# EAGLE design rls_slide_expand_01 (EAGLE 6.4)

## Sheet 1 of 2
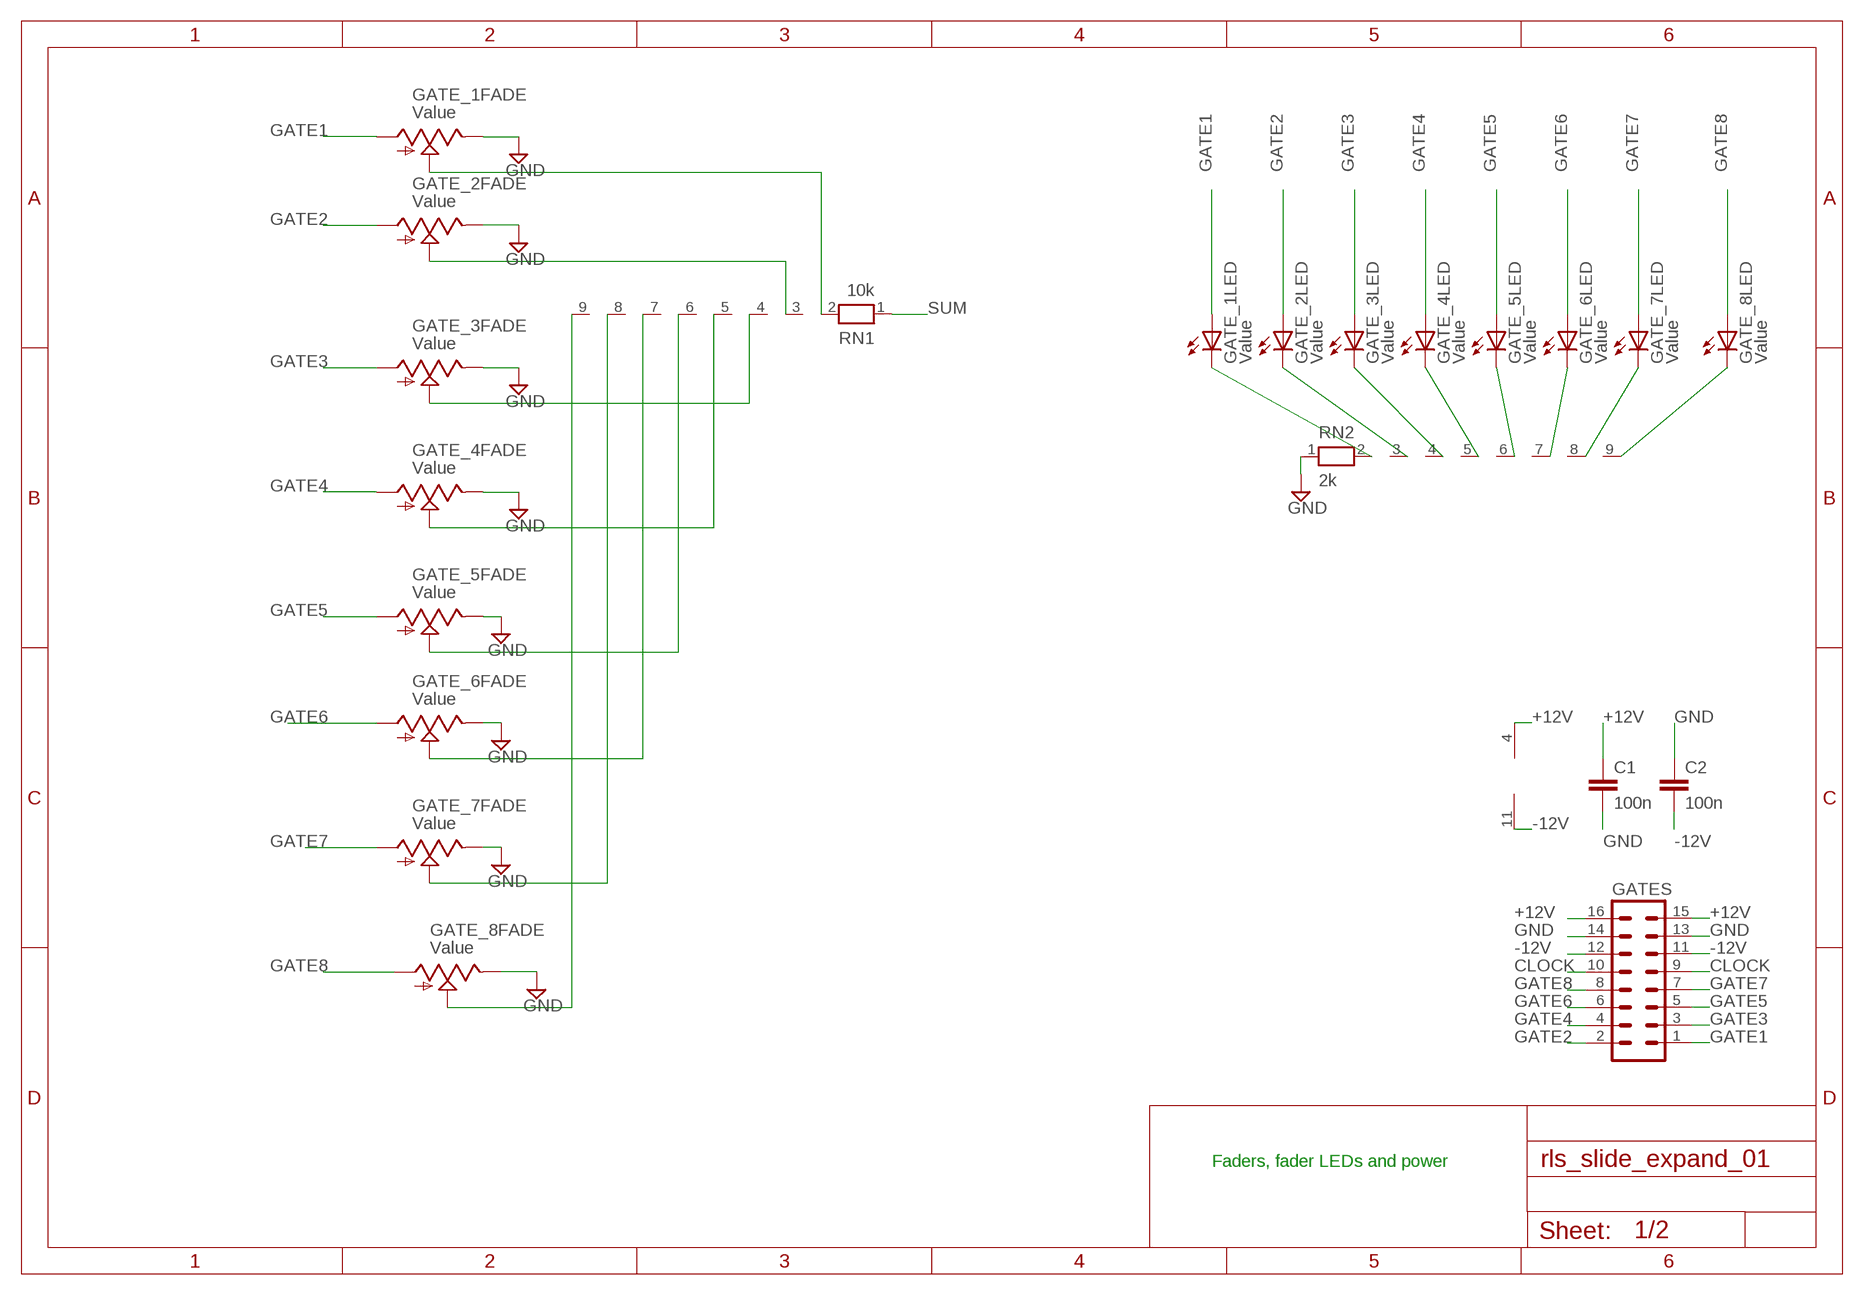
[diagram p0: schematic, sheet 1]

### Parts
C1  100n  C-EU050-024X044  [C050-024X044]
C2  100n  C-EU050-024X044  [C050-024X044]
GATE_1  Value  ALPHA_20MM_ILLUM_FADER  [ALPHA_ILL_FADER_20MM]
GATE_2  Value  ALPHA_20MM_ILLUM_FADER  [ALPHA_ILL_FADER_20MM]
GATE_3  Value  ALPHA_20MM_ILLUM_FADER  [ALPHA_ILL_FADER_20MM]
GATE_4  Value  ALPHA_20MM_ILLUM_FADER  [ALPHA_ILL_FADER_20MM]
GATE_5  Value  ALPHA_20MM_ILLUM_FADER  [ALPHA_ILL_FADER_20MM]
GATE_6  Value  ALPHA_20MM_ILLUM_FADER  [ALPHA_ILL_FADER_20MM]
GATE_7  Value  ALPHA_20MM_ILLUM_FADER  [ALPHA_ILL_FADER_20MM]
GATE_8  Value  ALPHA_20MM_ILLUM_FADER  [ALPHA_ILL_FADER_20MM]
GATES  MA08-2  [MA08-2]
IC1  TL074P  [DIL14]
RN1  10k  RN08  [RN-9]
RN2  2k  RN08  [RN-9]

### Nets
+12V [power]: C1.1 GATES.15 GATES.16 IC1.4(P:V+) ; also sheet 2
-12V [power]: C2.2 GATES.11 GATES.12 IC1.11(P:V-)
CLOCK: GATES.9 GATES.10 ; also sheet 2
GATE1: GATE_1.3(FADE:A) GATE_1.B(LED:A) GATES.1
GATE2: GATE_2.3(FADE:A) GATE_2.B(LED:A) GATES.2
GATE3: GATE_3.3(FADE:A) GATE_3.B(LED:A) GATES.3
GATE4: GATE_4.3(FADE:A) GATE_4.B(LED:A) GATES.4
GATE5: GATE_5.3(FADE:A) GATE_5.B(LED:A) GATES.5
GATE6: GATE_6.3(FADE:A) GATE_6.B(LED:A) GATES.6
GATE7: GATE_7.3(FADE:A) GATE_7.B(LED:A) GATES.7
GATE8: GATE_8.3(FADE:A) GATE_8.B(LED:A) GATES.8
GND [ground]: C1.2 C2.1 GATE_1.1(FADE:E) GATE_2.1(FADE:E) GATE_3.1(FADE:E) GATE_4.1(FADE:E) GATE_5.1(FADE:E) GATE_6.1(FADE:E) GATE_7.1(FADE:E) GATE_8.1(FADE:E) GATES.13 GATES.14 RN2.1 ; also sheet 2
N$2: GATE_1.2(FADE:S) RN1.2
N$3: GATE_1.E(LED:C) RN2.2
N$16: GATE_2.2(FADE:S) RN1.3
N$17: GATE_2.E(LED:C) RN2.3
N$18: GATE_3.E(LED:C) RN2.4
N$19: GATE_3.2(FADE:S) RN1.4
N$20: GATE_4.2(FADE:S) RN1.5
N$21: GATE_5.2(FADE:S) RN1.6
N$22: GATE_6.2(FADE:S) RN1.7
N$23: GATE_7.2(FADE:S) RN1.8
N$24: GATE_8.2(FADE:S) RN1.9
N$25: GATE_4.E(LED:C) RN2.5
N$26: GATE_6.E(LED:C) RN2.7
N$27: GATE_5.E(LED:C) RN2.6
N$28: GATE_7.E(LED:C) RN2.8
N$29: GATE_8.E(LED:C) RN2.9
SUM: RN1.1 ; also sheet 2

### Notes on the sheet
- Faders, fader LEDs and power

## Sheet 2 of 2
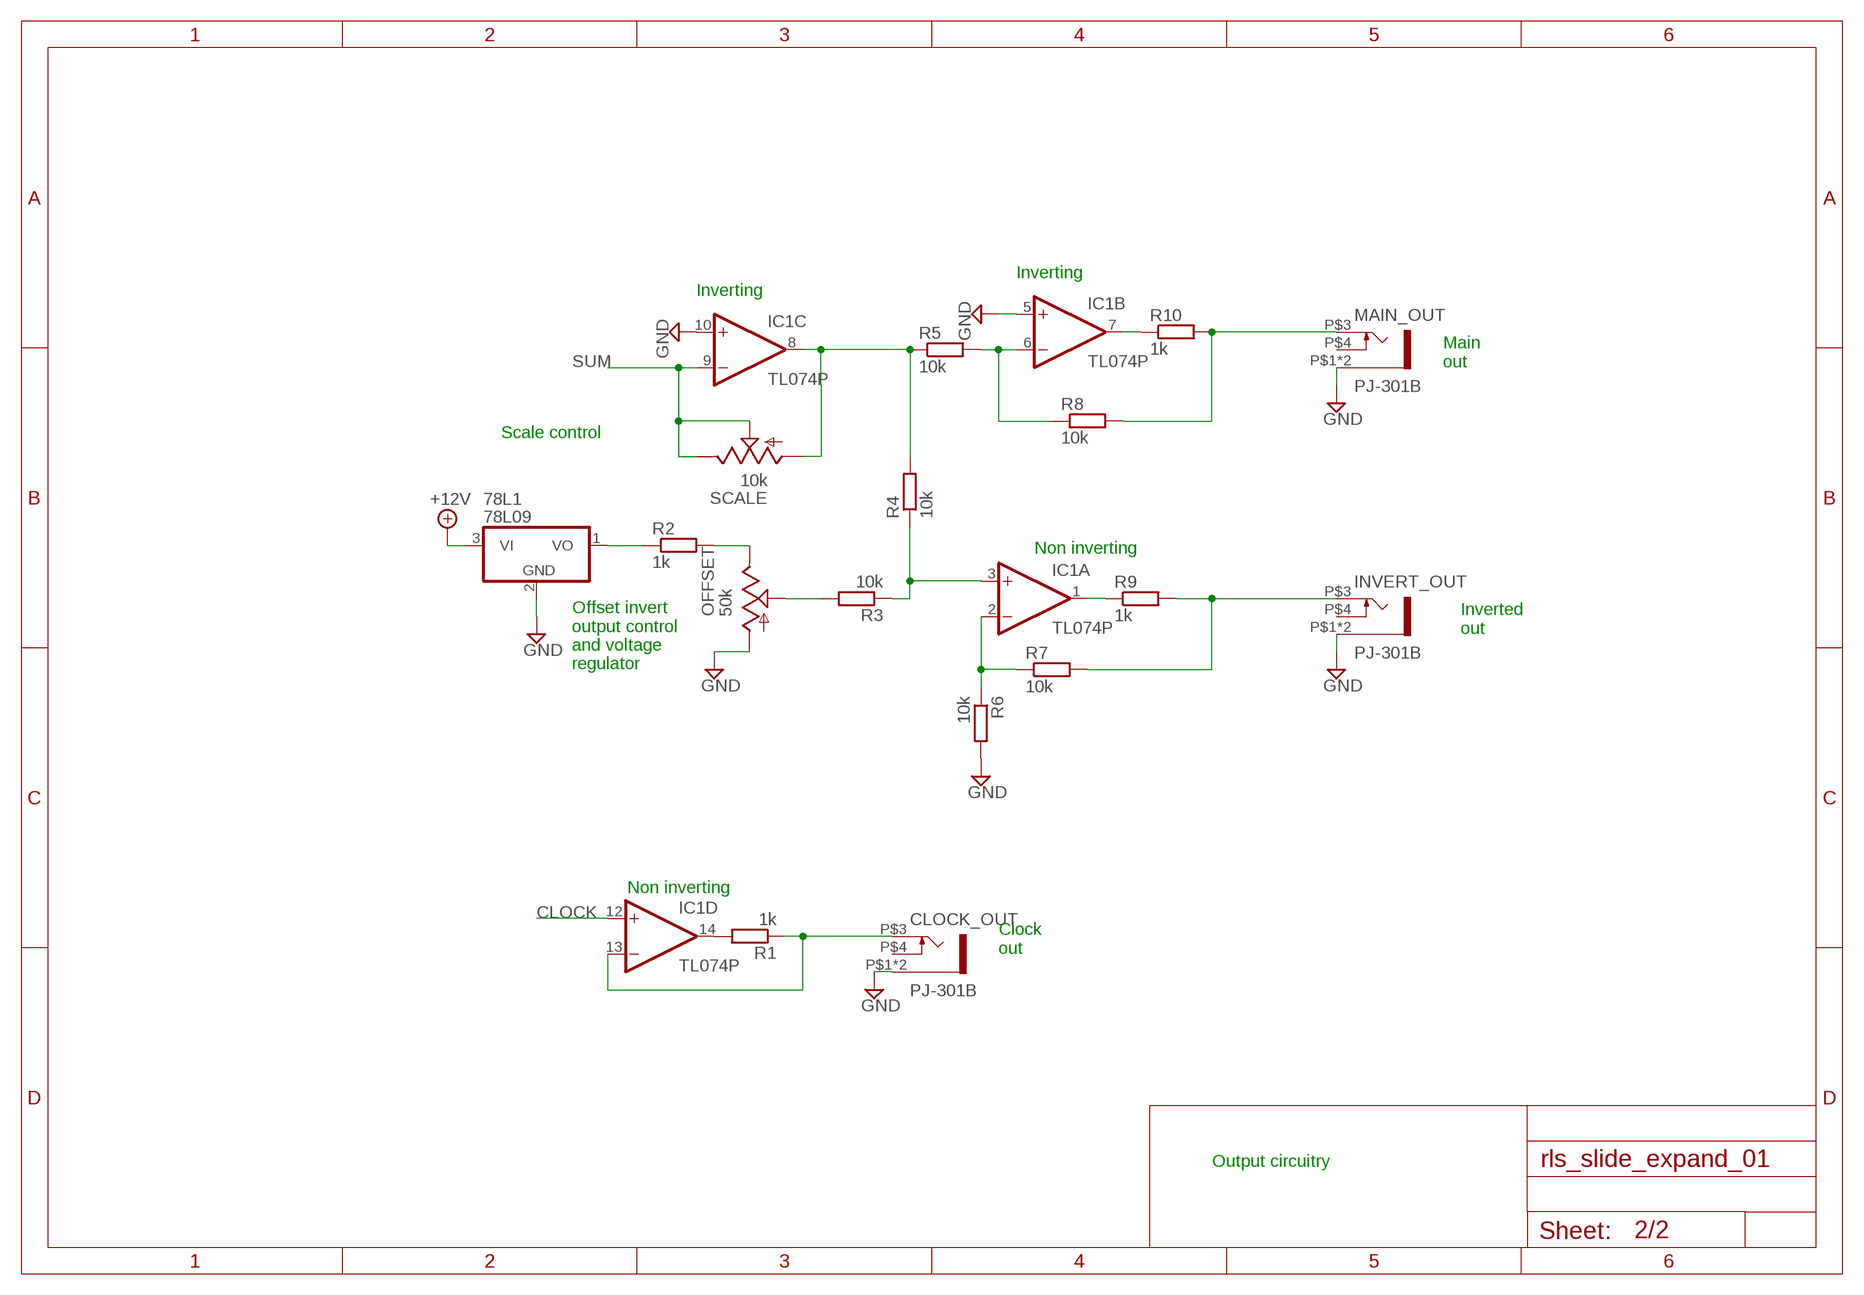
[diagram p1: schematic, sheet 2]

### Parts
78L1  78L09  7808L  [TO92]
CLOCK_OUT  PJ-301B  [PJ-301B]
INVERT_OUT  PJ-301B  [PJ-301B]
MAIN_OUT  PJ-301B  [PJ-301B]
OFFSET  50k  ALPHA-9MMF2A  [EVUF]
R1  1k  R-EU_0207/10  [0207/10]
R2  1k  R-EU_0207/10  [0207/10]
R3  10k  R-EU_0207/10  [0207/10]
R4  10k  R-EU_0207/10  [0207/10]
R5  10k  R-EU_0207/10  [0207/10]
R6  10k  R-EU_0207/10  [0207/10]
R7  10k  R-EU_0207/10  [0207/10]
R8  10k  R-EU_0207/10  [0207/10]
R9  1k  R-EU_0207/10  [0207/10]
R10  1k  R-EU_0207/10  [0207/10]
SCALE  10k  ALPHA-9MMF2A  [EVUF]

### Nets
+12V [power]: 78L1.3(VI) ; also sheet 1
CLOCK: IC1.12(D:+IN) ; also sheet 1
GND [ground]: 78L1.2(GND) CLOCK_OUT.P$1 CLOCK_OUT.P$2 IC1.5(B:+IN) IC1.10(C:+IN) INVERT_OUT.P$1 INVERT_OUT.P$2 MAIN_OUT.P$1 MAIN_OUT.P$2 OFFSET.1(A) R6.2 ; also sheet 1
N$4: IC1.6(B:-IN) R5.2 R8.1
N$5: MAIN_OUT.P$3 R8.2 R10.2
N$6: IC1.7(B:OUT) R10.1
N$7: OFFSET.3(E) R2.2
N$8: IC1.1(A:OUT) R9.1
N$9: OFFSET.2(S) R3.2
N$10: IC1.3(A:+IN) R3.1 R4.1
N$11: IC1.2(A:-IN) R6.1 R7.1
N$12: INVERT_OUT.P$3 R7.2 R9.2
N$15: IC1.8(C:OUT) R4.2 R5.1 SCALE.1(A)
N$30: IC1.14(D:OUT) R1.2
N$31: CLOCK_OUT.P$3 IC1.13(D:-IN) R1.1
N$32: 78L1.1(VO) R2.1
SUM: IC1.9(C:-IN) SCALE.2(S) SCALE.3(E) ; also sheet 1
Unconnected: CLOCK_OUT.P$4 INVERT_OUT.P$4 MAIN_OUT.P$4

### Notes on the sheet
- Inverting
- Inverting
- Main
  out
- Scale control
- Non inverting
- Inverted
  out
- Offset invert 
  output control
  and voltage 
  regulator
- Non inverting
- Clock
  out
- Output circuitry

## Library data of the parts
78L1 = linear:78*: Positive VOLTAGE REGULATOR Source: http://cache.national.com/ds/LM/LM78L05.pdf http://www.fairchildsemi.com/ds/LM/LM7805.pdf
C1 C2 = TomW:C-EU: CAPACITOR, European symbol
CLOCK_OUT INVERT_OUT MAIN_OUT = TomW:PJ-301B
GATE_1-GATE_8 = TomW:ALPHA_20MM_ILLUM_FADER: 30mm Alpha Illuminated Fader
GATES = con-lstb:MA08-2: PIN HEADER; OC_FARNELL: unknown; OC_NEWARK: unknown
IC1 = linear:TL074: OP AMP
OFFSET SCALE = TomW:ALPHA-9MM: 9 mm Square Rotary Potentiometers Source: Panasonic
R1-R10 = TomW:R-EU_: RESISTOR, European symbol
RN1 RN2 = TomW:RN08: RESISTOR NETWORK; OC_FARNELL: unknown; OC_NEWARK: unknown

## Net classes
0 default: width 0.61 mm
1 power: width 0.914 mm
2 ground: width 0.914 mm

## Board
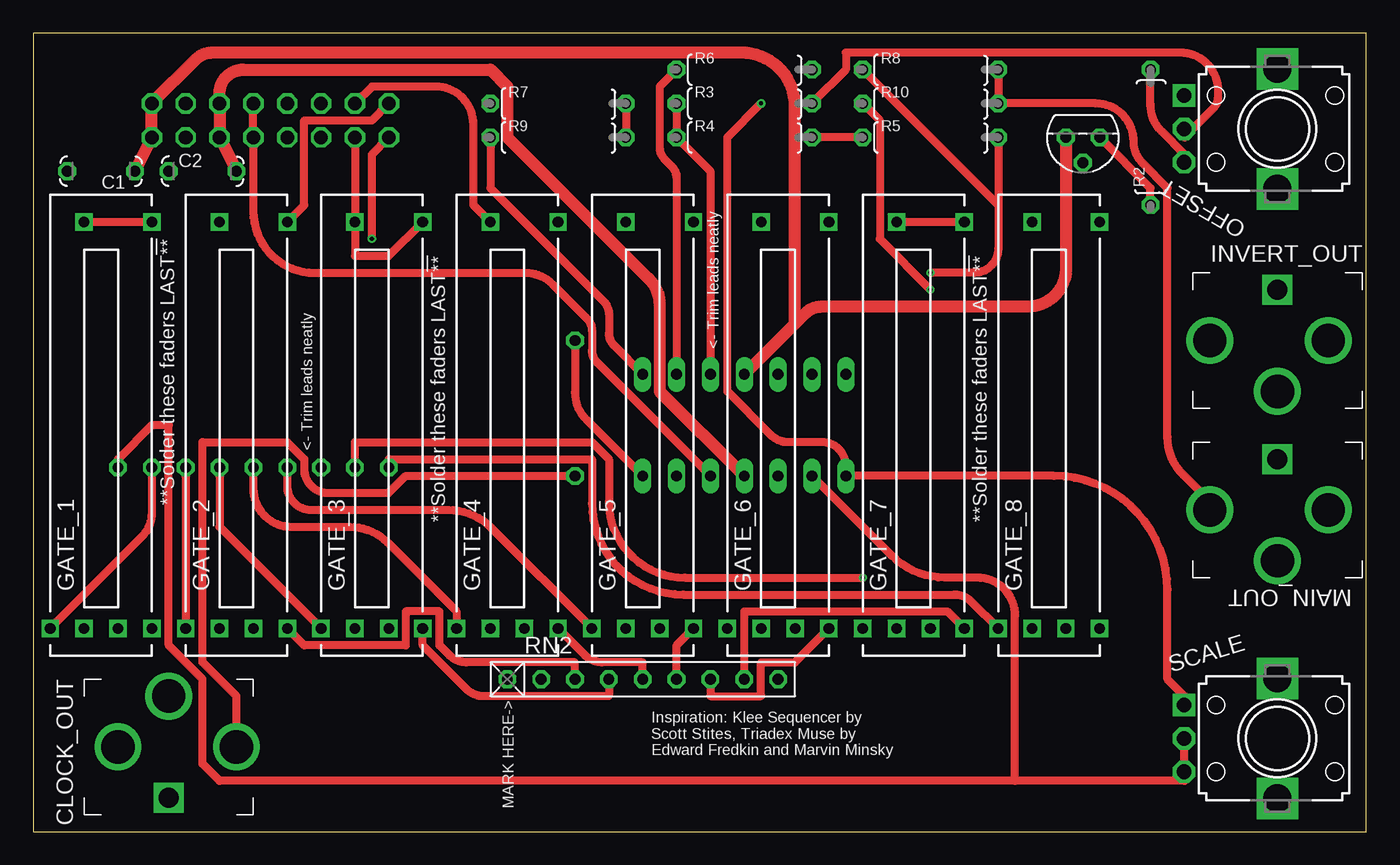
[diagram p2: board, top side]
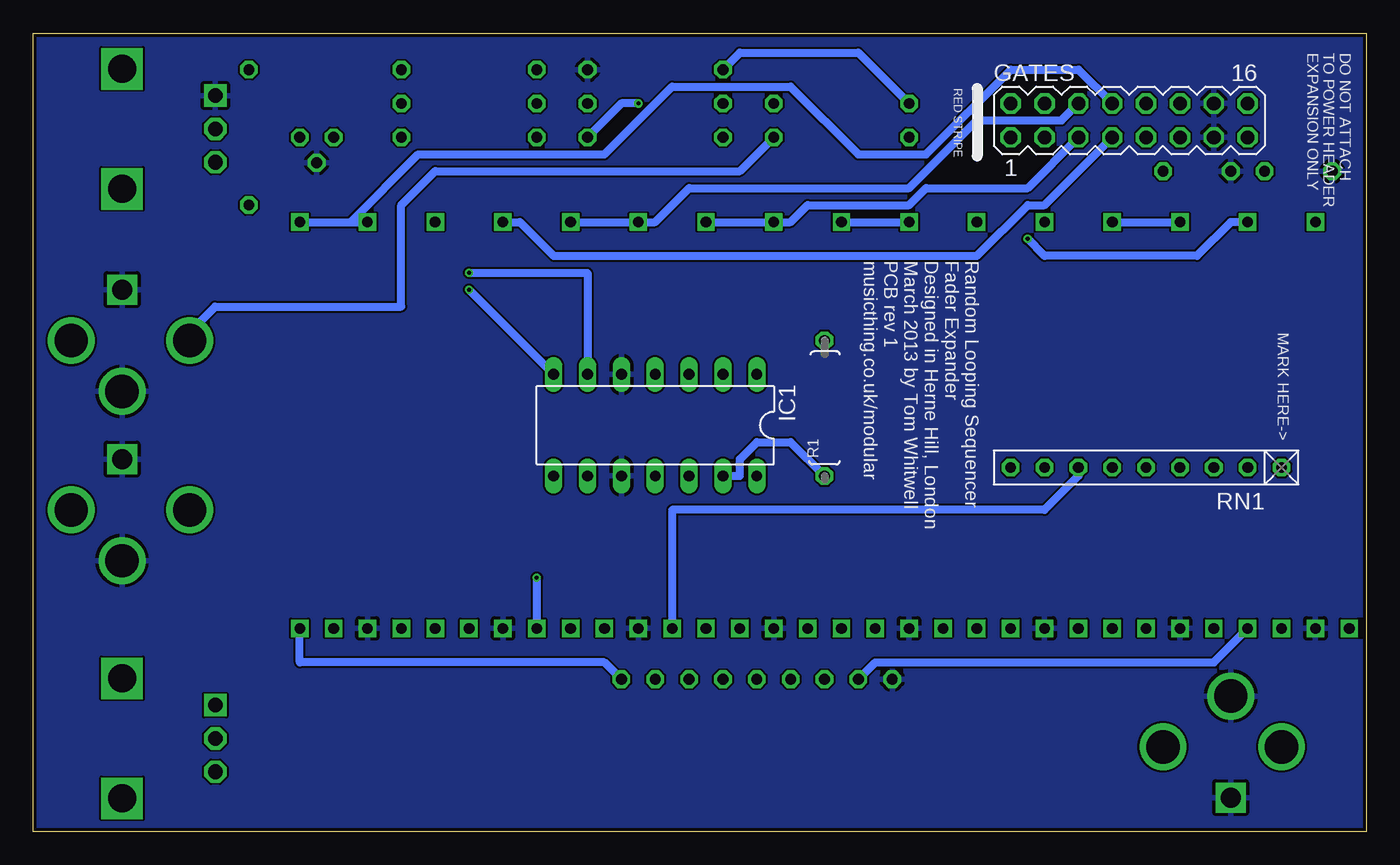
[diagram p3: board, bottom side, seen from below]

Size 100 x 59.87 mm. Coordinates in mm from the lower left corner, seen from the top.
Outline: 0,0 100,0 100,59.87 0,59.87 0,0
Copper layers (1*16): Top 0.035mm / dielectric 1.5mm / Bottom 0.035mm
Design rules "ITead_rule": minimum track width 6mil, minimum drill 12mil, track to track 6mil, track to pad 6mil, pad to pad 6mil, via to via 6mil, smd to smd 0mil, copper to edge 10mil, drill to drill 10mil, minimum pad ring 10mil, minimum via ring 6mil, stop-mask expansion 2mil, vias tented up to drill 100mil, thermal gap 10mil

### Footprints (pad centres in the part's own frame; a part is rotated, then mirrored left to right if it is on the bottom)
TO92 = drill 0.813 octagon: 1 -1.27,0; 2 0,1.905; 3 1.27,0
C050-024X044 = drill 0.813 octagon: 1 -2.54,0; 2 2.54,0
PJ-301B = drill 1.5 square: P$1 3.81,0 | drill 2.5: P$2 -3.81,0; P$3 0,5.08; P$4 0,-3.81
ALPHA_ILL_FADER_20MM = drill 0.8 square: 1 -15.24,1.27; 2 -15.24,3.81; 3 15.24,1.27; B 15.24,-3.81; E -15.24,-3.81; L -15.24,-1.27
MA08-2 = drill 1.016 octagon: 1 -8.89,-1.27; 2 -8.89,1.27; 3 -6.35,-1.27; 4 -6.35,1.27; 5 -3.81,-1.27; 6 -3.81,1.27; 7 -1.27,-1.27; 8 -1.27,1.27; 9 1.27,-1.27; 10 1.27,1.27; 11 3.81,-1.27; 12 3.81,1.27; 13 6.35,-1.27; 14 6.35,1.27; 15 8.89,-1.27; 16 8.89,1.27
DIL14 = drill 0.813 long: 1 -7.62,-3.81; 2 -5.08,-3.81; 3 -2.54,-3.81; 4 0,-3.81; 5 2.54,-3.81; 6 5.08,-3.81; 7 7.62,-3.81; 8 7.62,3.81; 9 5.08,3.81; 10 2.54,3.81; 11 0,3.81; 12 -2.54,3.81; 13 -5.08,3.81; 14 -7.62,3.81
EVUF = drill 1.1 pad 1.676 square: 1 -2.5,-7 | drill 1.1 pad 1.676 octagon: 2 0,-7; 3 2.5,-7 | drill 2.1 pad 2.8 square: M1 4.5,0; M2 -4.5,0
0207/10 = drill 0.813 octagon: 1 -5.08,0; 2 5.08,0
RN-9 = drill 0.813 octagon: 1 -10.16,0; 2 -7.62,0; 3 -5.08,0; 4 -2.54,0; 5 0,0; 6 2.54,0; 7 5.08,0; 8 7.62,0; 9 10.16,0

### Placement (x,y rotation side)
78L1  78.74,52.07 180 top
C1  5.08,49.53 180 top
C2  12.7,49.53 0 top
CLOCK_OUT  10.16,6.35 270 top
GATE_1  5.08,30.48 90 top
GATE_2  15.24,30.48 90 top
GATE_3  25.4,30.48 90 top
GATE_4  35.56,30.48 90 top
GATE_5  45.72,30.48 90 top
GATE_6  55.88,30.48 90 top
GATE_7  66.04,30.48 90 top
GATE_8  76.2,30.48 90 top
GATES  17.78,53.34 0 bottom
IC1  53.34,30.48 180 bottom
INVERT_OUT  93.34,36.83 90 top
MAIN_OUT  93.34,24.13 90 top
OFFSET  93.34,52.7 270 top
R1  40.64,31.75 90 bottom
R2  83.82,52.07 90 top
R3  53.34,54.61 0 top
R4  53.34,52.07 0 top
R5  67.31,52.07 0 top
R6  53.34,57.15 0 top
R7  39.37,54.61 0 top
R8  67.31,57.15 0 top
R9  39.37,52.07 0 top
R10  67.31,54.61 0 top
RN1  16.51,27.3 180 bottom
RN2  45.72,11.43 0 top
SCALE  93.34,6.99 270 top

### Tracks (layer width: path | path; a pad name or v marks a point on that pad's centre or on a via)
+12V
  Top 0.914: C1.1 GATES.15 GATES.16 12.17,57.89 arc-45 13.44,58.42 53.13,58.42 arc-90 57.15,54.4 57.15,38.1 | 57.15,38.1 57.89,38.84 arc-45 59.16,39.37 74.63,39.37 arc90 77.47,42.21 78L1.3 | 57.15,38.1 IC1.4
-12V
  Top 0.914: C2.2 GATES.11 GATES.12 13.97,55.35 arc-90 15.77,57.15 34.29,57.15 35.56,55.88 35.56,52.07 46.16,41.47 arc-45 46.99,39.46 46.99,33.02 IC1.11
CLOCK
  Top 0.61: IC1.12 42.28,35.19 arc-45 41.91,36.09 41.91,37.57 arc45 41.54,38.47 38.93,41.08 arc45 36.92,41.91 21.09,41.91 arc-90 16.51,46.49 GATES.9 GATES.10
GATE1  (via drill 0.3)
  Top 0.61: GATE_1.B GATE_1.3 | GATES.1 25.4,50.8 v25.4,44.45
  Bottom 0.61: v25.4,44.45 24.13,43.18 12.7,43.18 10.16,45.72 GATE_1.B
GATE2
  Top 0.61: GATES.2 25.4,53.34 20.32,53.34 20.32,46.99 GATE_2.B
  Bottom 0.61: GATE_2.B GATE_2.3
GATE3
  Top 0.61: GATES.3 GATE_3.3 24.13,43.18 26.67,43.18 GATE_3.B
GATE4
  Top 0.61: GATES.4 25.4,55.88 30.18,55.88 arc-90 33.02,53.04 33.02,46.99 GATE_4.3
  Bottom 0.61: GATE_4.B GATE_4.3
GATE5
  Bottom 0.61: GATE_5.B GATE_5.3 43.18,45.72 41.91,46.99 34.29,46.99 33.02,48.26 25.4,48.26 GATES.5
GATE6
  Bottom 0.61: GATE_6.B GATE_6.3 53.34,45.72 50.8,48.26 34.29,48.26 29.21,53.34 22.86,53.34 GATES.6
GATE7
  Top 0.61: GATE_7.B GATE_7.3
  Bottom 0.61: GATES.7 24.13,46.99 25.4,46.99 29.21,43.18 60.96,43.18 63.5,45.72 GATE_7.3
GATE8
  Bottom 0.61: GATE_8.B 76.2,45.72 | 76.2,45.72 GATE_8.3 | GATES.8 21.59,57.15 26.67,57.15 33.02,50.8 38.1,50.8 43.18,55.88 52.07,55.88 57.15,50.8 71.12,50.8 76.2,45.72
GND
  pour Bottom: 0,60.96 100.97,60.96 100.97,-1.27 0,-1.27
N$2
  Top 0.61: GATE_1.2 8.15,22.12 arc45 8.89,23.91 8.89,26.67 RN1.2
N$3
  Bottom 0.61: GATE_1.E 11.43,12.7 36.83,12.7 RN2.2
N$4  (via drill 0.3)
  Top 0.61: 72.39,46.99 72.39,43.71 arc-90 70.59,41.91 v67.31,41.91 | R5.2 72.39,46.99 | 72.39,46.99 R8.1
  Bottom 0.61: IC1.6 58.42,41.91 v67.31,41.91
N$5
  Top 0.61: R8.2 R10.2 79.71,54.61 arc-90 82.55,51.77 arc45 83.24,50.11 85.09,48.26 85.09,29.6 arc45 86.27,26.76 87.63,25.4 87.63,24.13 MAIN_OUT.P$3
N$6  (via drill 0.3)
  Top 0.61: v67.31,40.64 63.5,44.45 63.5,53.34 R10.1
  Bottom 0.61: v67.31,40.64 IC1.7
N$7
  Top 0.61: R2.2 83.82,54.52 arc45 84.65,52.51 86.36,50.8 OFFSET.3
N$8
  Top 0.61: IC1.1 43.55,36.46 arc-45 43.18,37.36 43.18,38.84 arc45 42.81,39.74 34.29,48.26 R9.1
N$9
  Top 0.61: R3.2 60.96,57.15 60.96,58.42 86.06,58.42 arc-90 88.9,55.58 88.9,55.14 arc-45 88.53,54.24 86.36,52.07 OFFSET.2
N$10
  Top 0.61: R3.1 R4.1 50.8,49.53 IC1.3
N$11
  Top 0.61: IC1.2 48.26,49 arc45 47.89,49.9 47.36,50.43 arc-45 46.99,51.33 46.99,55.88 R6.1
  Bottom 0.61: R7.1 38.1,58.42 46.99,58.42 R6.1
N$12
  Top 0.61: R7.2 R9.2
  Bottom 0.61: R9.2 46.99,49.53 69.85,49.53 72.39,46.99 72.39,39.37 86.36,39.37 88.9,36.83 INVERT_OUT.P$3
N$15  (via drill 0.3)
  Top 0.61: R5.1 R4.2 | SCALE.1 86.36,10.16 85.09,11.43 85.09,18.15 arc90 76.57,26.67 IC1.8 60.96,27.41 arc90 59.16,29.21 56.62,29.21 arc-45 55.35,29.74 52.07,33.02 52.07,52.07 v54.61,54.61
  Bottom 0.61: R4.2 55.88,54.61 v54.61,54.61
N$16
  Top 0.61: GATE_2.2 11.43,26.67 RN1.3
N$17
  Top 0.61: GATE_2.E 20.32,13.97 27.94,13.97 27.94,16.51 30.48,16.51 30.48,13.97 31.22,13.23 arc45 32.49,12.7 40.64,12.7 RN2.3
N$18
  Top 0.61: GATE_3.E 29.21,13.97 32.49,10.69 arc45 33.76,10.16 43.18,10.16 RN2.4
N$19
  Top 0.61: GATE_3.2 13.97,22.86 13.97,26.67 RN1.4
N$20
  Top 0.61: GATE_4.2 31.75,16.51 26.58,21.68 arc45 23.74,22.86 19.35,22.86 arc-90 16.51,25.7 16.51,26.67 RN1.5
N$21
  Top 0.61: GATE_5.2 34.36,22.79 arc45 31.12,24.13 20.85,24.13 arc-90 19.05,25.93 19.05,26.67 RN1.6
N$22
  Bottom 0.61: GATE_6.2 52.07,24.13 24.13,24.13 21.59,26.67 RN1.7
N$23  (via drill 0.3)
  Top 0.61: v62.23,19.05 48.86,19.05 arc-90 43.18,24.73 43.18,27.94 41.91,29.21 24.13,29.21 24.13,27.94 RN1.8
  Bottom 0.61: v62.23,19.05 GATE_7.2
N$24
  Top 0.61: GATE_8.2 70.38,17.25 arc45 69.11,17.78 48.75,17.78 arc-90 41.91,24.62 41.91,27.94 26.67,27.94 RN1.9
N$25
  Top 0.61: GATE_4.E 41.38,13.23 arc45 42.65,12.7 45.72,12.7 RN2.5
N$26
  Top 0.61: GATE_6.E 57.15,12.7 54.61,12.7 54.61,10.16 50.8,10.16 RN2.7
N$27
  Top 0.61: GATE_5.E 48.26,13.97 RN2.6
N$28
  Top 0.61: GATE_7.E 68.58,16.51 53.34,16.51 RN2.8
N$29
  Bottom 0.61: GATE_8.E 80.01,12.7 57.15,12.7 RN2.9
N$30
  Top 0.61: R1.2 40.64,32.93 arc45 41.47,30.92 IC1.14
N$31
  Top 0.61: R1.1 27.94,26.67 26.67,25.4 22.12,25.4 arc-90 20.32,27.2 20.32,27.94 19.05,29.21 12.7,29.21 12.7,12.7 15.24,10.16 CLOCK_OUT.P$3
  Bottom 0.61: R1.1 43.18,29.21 45.72,29.21 46.99,27.94 46.99,26.67 IC1.13
N$32
  Top 0.61: 78L1.1 83.82,48.26 R2.1
SUM
  Top 0.61: 73.66,3.81 86.36,3.81 SCALE.3 86.36,5.08 86.36,6.35 SCALE.2 | 73.66,3.81 13.97,3.81 12.7,5.08 12.7,11.43 10.16,13.97 10.16,30.48 8.89,30.48 6.35,27.94 RN1.1 | IC1.9 64.38,20.71 arc45 68.39,19.05 70.82,19.05 arc-90 73.66,16.21 73.66,3.81

### Text on the board
tPlace: **Solder these faders LAST!** | **Solder these faders LAST!** | **Solder these faders LAST!** | <- Trim leads neatly | <- Trim leads neatly | Inspiration: Klee Sequencer by / Scott Stites, Triadex Muse by / Edward Fredkin and Marvin Minsky | MARK HERE->
bPlace: DO NOT ATTACH / TO POWER HEADER / EXPANSION ONLY | RED STRIPE | Random Looping Sequencer / Fader Expander / Designed in Herne Hill, London / March 2013 by Tom Whitwell / PCB rev 1 / musicthing.co.uk/modular | MARK HERE->